# EasyEDA Pro project 校赛123.eprj, schematic Schematic2
Board Name: Board2; Create Date: 2025-10-29; Page Name: P1; Project Name: 校赛123; Schematic Name: Schematic2; Update Date: 2025-11-05; Company: 嘉立创EDA; Page Size: A4; Version: V1.0
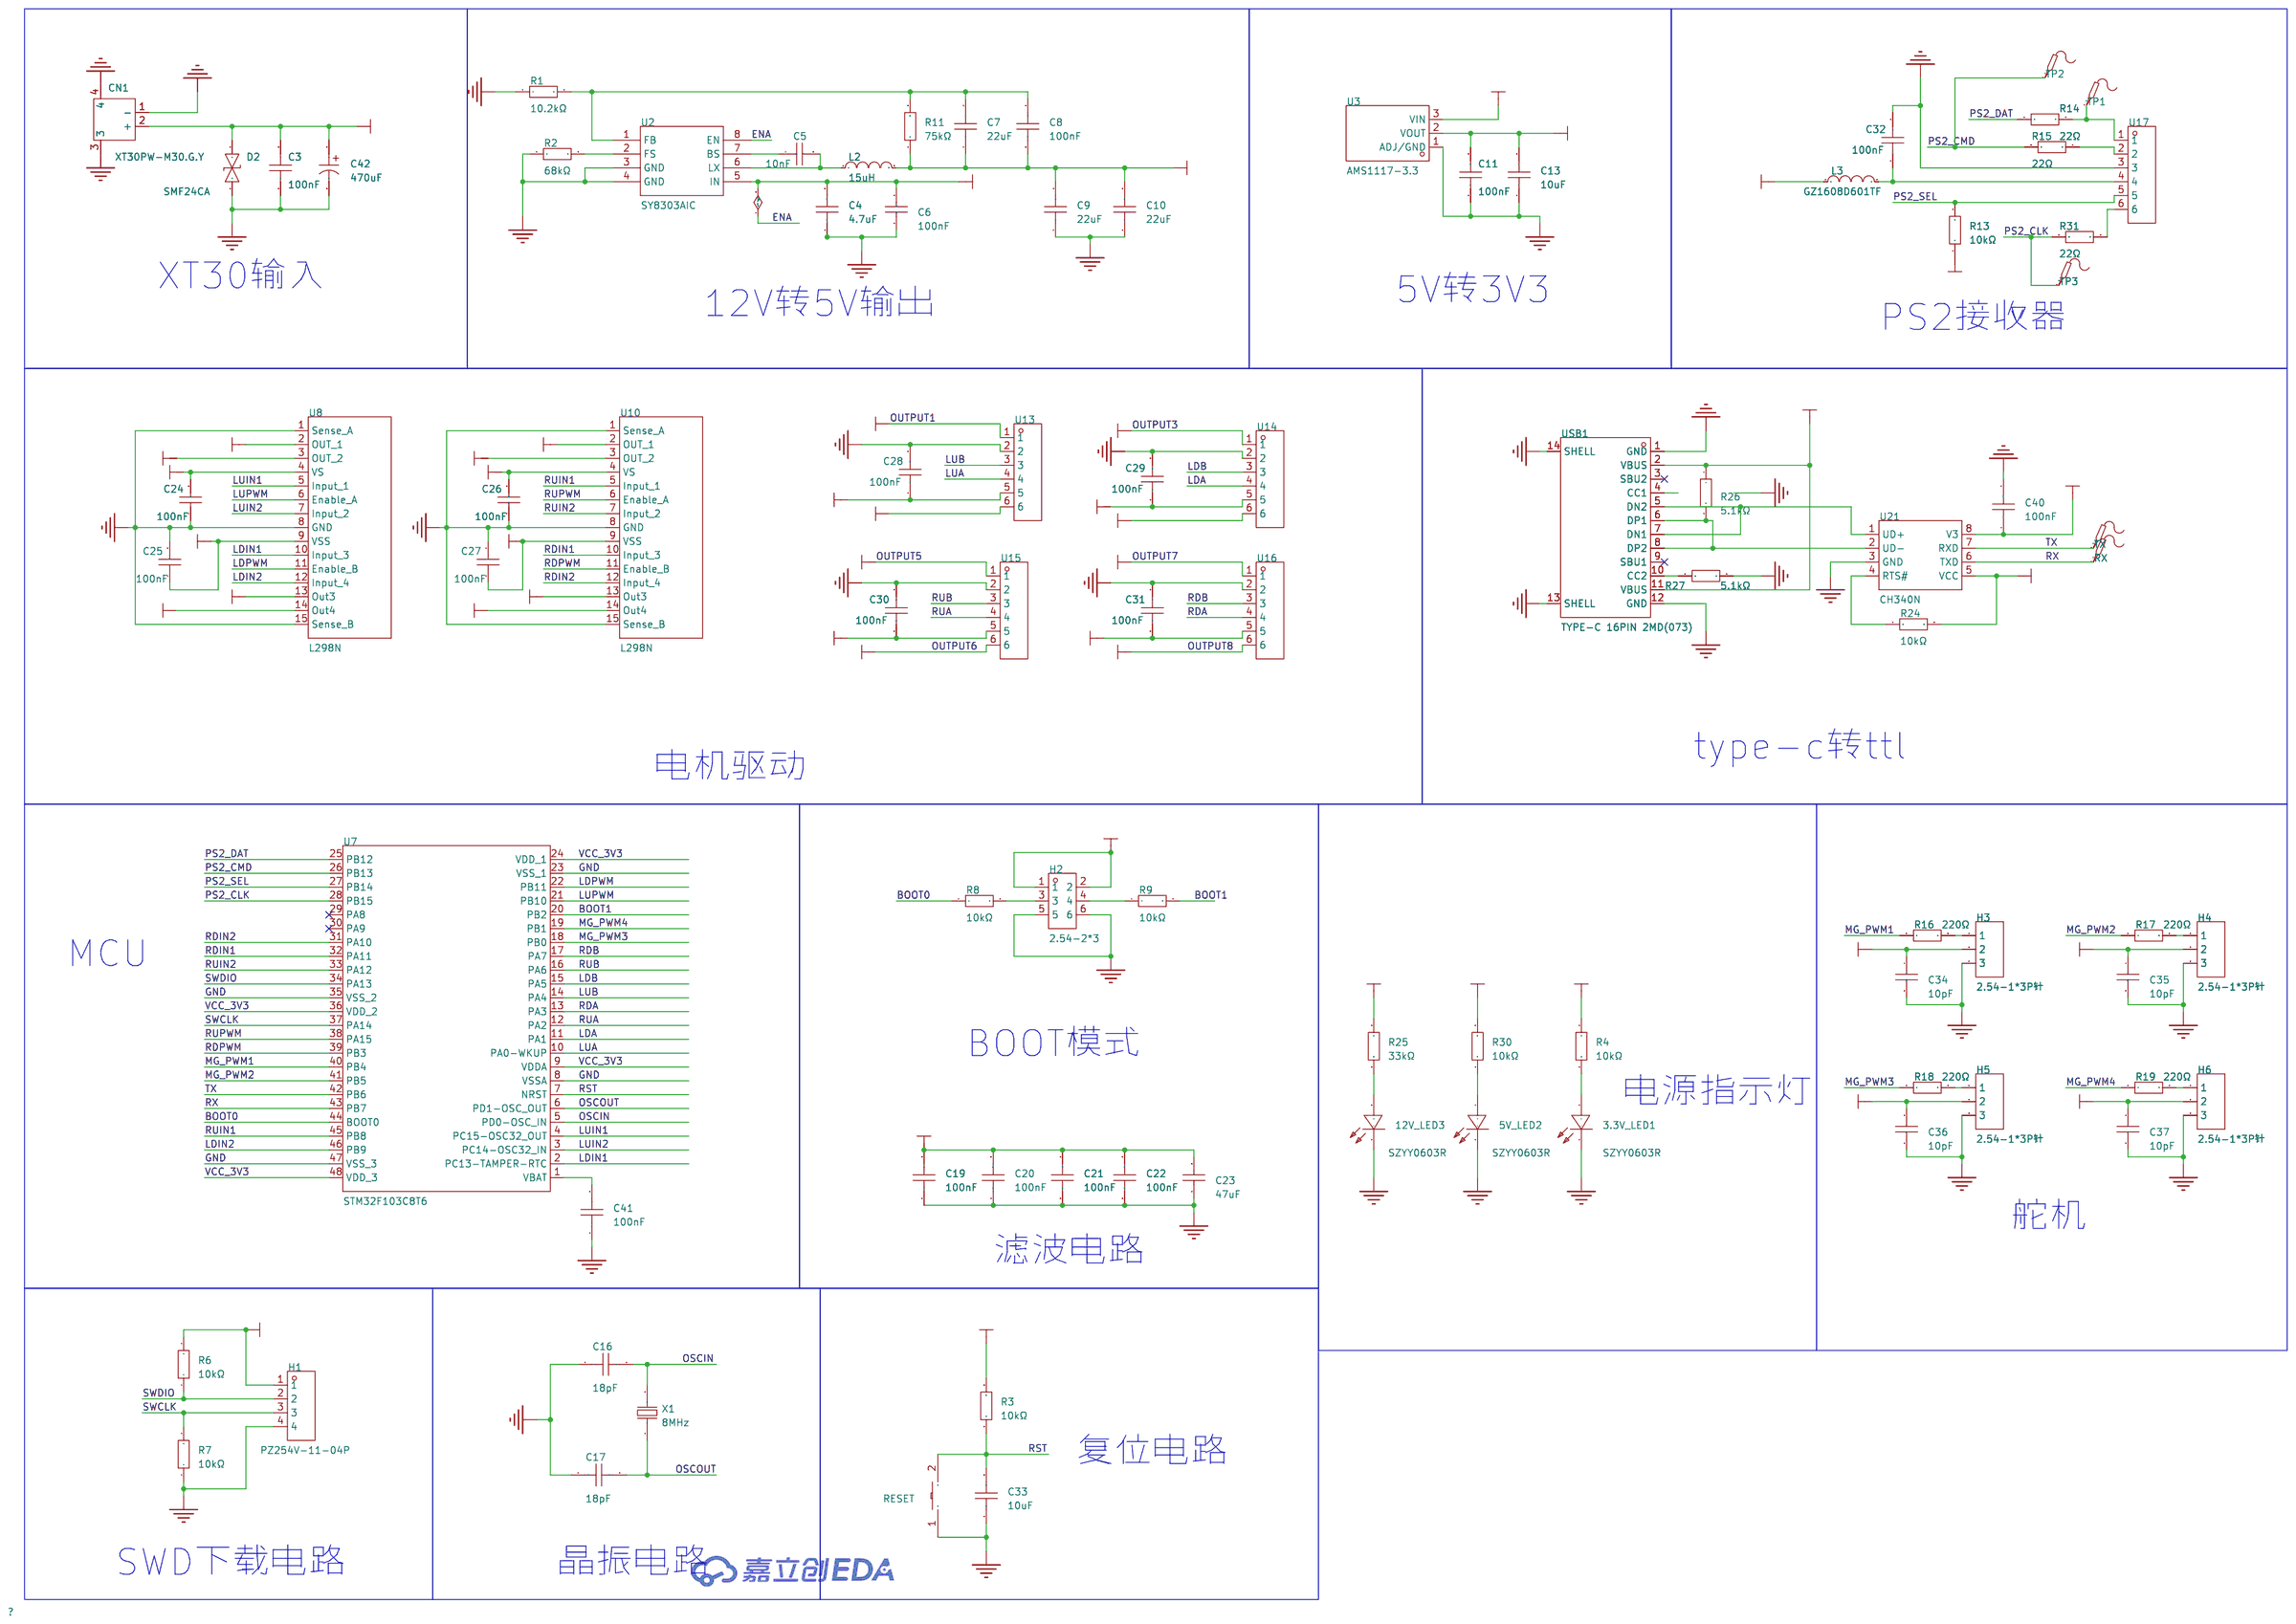
[diagram p1: schematic sheet]

## Parts
3.3V_LED1  SZYY0603R  [LED0603-R-RD]
5V_LED2  SZYY0603R  [LED0603-R-RD]
12V_LED3  SZYY0603R  [LED0603-R-RD]
C3  100nF  [C0603]
C4  4.7uF  [C0603]
C5  10nF  [C0603]
C6  100nF  [C0603]
C7  22uF  [C0603]
C8  100nF  [C0603]
C9  22uF  [C0603]
C10  22uF  [C0603]
C11  100nF  [C0603]
C13  10uF  [C0603]
C16  18pF  [C0603]
C17  18pF  [C0603]
C19  100nF  [C0603]
C20  100nF  [C0603]
C21  100nF  [C0603]
C22  100nF  [C0603]
C23  47uF  [C0603]
C24  100nF  [C0603]
C25  100nF  [C0603]
C26  100nF  [C0603]
C27  100nF  [C0603]
C28  100nF  [C0603]
C29  100nF  [C0603]
C30  100nF  [C0603]
C31  100nF  [C0603]
C32  100nF  [C0603]
C33  10uF  [C0603]
C34  10pF  [C0603]
C35  10pF  [C0603]
C36  10pF  [C0603]
C37  10pF  [C0603]
C40  100nF  [C0603]
C41  100nF  [C0603]
C42  470uF  [CAP-SMD_BD10.0-L10.3-W10.3-LS11.0]
CN1  XT30PW-M30.G.Y  [CONN-TH_XT30PW-M]
D2  SMF24CA  [SOD-123FL_L2.7-W1.8-LS3.8-BI]
H1  PZ254V-11-04P  [HDR-TH_4P-P2.54-V-M]
H2  2.54-2*3  [HDR-TH_6P-P2.54-V-R2-C3-S2.54_A2541WV-2X3P]
H3  2.54-1*3P针  [HDR-TH_3P-P2.54-V-M-1]
H4  2.54-1*3P针  [HDR-TH_3P-P2.54-V-M-1]
H5  2.54-1*3P针  [HDR-TH_3P-P2.54-V-M-1]
H6  2.54-1*3P针  [HDR-TH_3P-P2.54-V-M-1]
L2  15uH  [IND-SMD_L4.0-W4.0]
L3  GZ1608D601TF  [L0603]
R1  10.2kΩ  [R0603]
R2  68kΩ  [R0603]
R3  10kΩ  [R0603]
R4  10kΩ  [R0603]
R6  10kΩ  [R0603]
R7  10kΩ  [R0603]
R8  10kΩ  [R0603]
R9  10kΩ  [R0603]
R11  75kΩ  [R0603]
R13  10kΩ  [R0603]
R14  22Ω  [R0603]
R15  22Ω  [R0603]
R16  220Ω  [R0603]
R17  220Ω  [R0603]
R18  220Ω  [R0603]
R19  220Ω  [R0603]
R24  10kΩ  [R0603]
R25  33kΩ  [R0603]
R26  5.1kΩ  [R0603]
R27  5.1kΩ  [R0603]
R30  10kΩ  [R0603]
R31  22Ω  [R0603]
RESET  TS-1101-C-W  [SW-SMD_L6.0-W3.3-LS8.0]
RX  -  [Test-Point-0.5mm]
TP1  -  [Test-Point-0.5mm]
TP2  -  [Test-Point-0.5mm]
TP3  -  [Test-Point-0.5mm]
TX  -  [Test-Point-0.5mm]
U2  SY8303AIC  [TSOT-23-8_L2.9-W1.6-P0.65-LS2.8-BR]
U3  AMS1117-3.3  [SOT-89-3_L4.5-W2.5-P1.50-LS4.2-BR]
U7  STM32F103C8T6  [LQFP-48_L7.0-W7.0-P0.50-LS9.0-BL]
U8  L298N  [MULTIWATT-15_L19.6-W5.0-P1.27-L]
U10  L298N  [MULTIWATT-15_L19.6-W5.0-P1.27-L]
U13  ZX-XH2.54-6PZZ  [CONN-TH_6P-P2.50_ZX-XH2.54-6PZZ]
U14  ZX-XH2.54-6PZZ  [CONN-TH_6P-P2.50_ZX-XH2.54-6PZZ]
U15  ZX-XH2.54-6PZZ  [CONN-TH_6P-P2.50_ZX-XH2.54-6PZZ]
U16  ZX-XH2.54-6PZZ  [CONN-TH_6P-P2.50_ZX-XH2.54-6PZZ]
U17  ZX-XH2.54-6PZZ  [CONN-TH_6P-P2.50_ZX-XH2.54-6PZZ]
U21  CH340N  [SOP-8_L4.9-W3.9-P1.27-LS6.0-BL]
USB1  TYPE-C 16PIN 2MD(073)  [USB-C-SMD_TYPE-C-6PIN-2MD-073]
X1  8MHz  [CRYSTAL-SMD_L11.4-W4.7-LS12.7]

## Library data of the parts
3.3V_LED1 5V_LED2 12V_LED3 = SZYY0603R: 发光颜色:红色;功率:40mW;正向电流:20mA;主波长:615nm~630nm;二极管配置:-;透镜颜色:无色透明透镜;色温:-;发光角度:120°;载带方式:-;工作温度:-40℃~+85℃;; LCSC Part Name: 红灯; Supplier Part: C434419; Manufacturer: yongyu(永裕光电); Supplier Footprint: 0603; JLCPCB Part Class: 扩展库; Datasheet: https://atta.szlcsc.com/upload/public/pdf/source/20191204/C434419_0B955C1F73FF88449D9A795B6FF49070.pdf; Supplier: LCSC; Emitted Color: 红色; Power Dissipation: 40mW; Forward Current: 20mA; Dominant Wavelength: 615nm~630nm; Peak Wavelength: 645nm; Lens Color: 无色透明透镜; Viewing Angle: 120°; Operating Temperature: -40℃~+85℃
C3 C11 C22 C28-C32 C40 = CL10B104KB8NNNC: LCSC Part Name: 100nF ±10% 50V; Supplier Part: C1591; Manufacturer: SAMSUNG(三星); Supplier Footprint: 0603; JLCPCB Part Class: 扩展库; Datasheet: https://item.szlcsc.com/datasheet/CL10B104KB8NNNC/1943.html; Supplier: LCSC; Tolerance: ±10%; Voltage Rating: 50V; Temperature Coefficient: X7R
C4 = CL10A475KO8NNNC: LCSC Part Name: 4.7uF ±10% 16V; Supplier Part: C19666; Manufacturer: SAMSUNG(三星); Supplier Footprint: 0603; JLCPCB Part Class: Basic Part; Datasheet: https://item.szlcsc.com/datasheet/CL10A475KO8NNNC/20375.html; Supplier: LCSC; Tolerance: ±10%; Voltage Rating: 16V; Temperature Coefficient: X5R
C5 = CC0603KRX7R9BB103: LCSC Part Name: 10nF ±10% 50V; Supplier Part: C100042; Manufacturer: YAGEO(国巨); Supplier Footprint: 0603; JLCPCB Part Class: Extended Part; Datasheet: https://item.szlcsc.com/datasheet/CC0603KRX7R9BB103/101256.html; Supplier: LCSC; Tolerance: ±10%; Voltage Rating: 50V; Temperature Coefficient: X7R
C6 C8 C19-C21 C24-C27 = CL10B104KB8NNNC: LCSC Part Name: 100nF ±10% 50V; Supplier Part: C1591; Manufacturer: SAMSUNG(三星); Supplier Footprint: 0603; JLCPCB Part Class: Extended Part; Datasheet: https://item.szlcsc.com/datasheet/CL10B104KB8NNNC/1943.html; Supplier: LCSC; Tolerance: ±10%; Voltage Rating: 50V; Temperature Coefficient: X7R
C7 C9 C10 = CL10A226MQ8NRNC: LCSC Part Name: 22uF ±20% 6.3V; Supplier Part: C59461; Manufacturer: SAMSUNG(三星); Supplier Footprint: 0603; JLCPCB Part Class: Basic Part; Datasheet: https://item.szlcsc.com/datasheet/CL10A226MQ8NRNC/60514.html; Supplier: LCSC; Tolerance: ±20%; Voltage Rating: 6.3V; Temperature Coefficient: X5R
C13 C33 = CL10A106KP8NNNC: LCSC Part Name: 10uF ±10% 10V; Supplier Part: C19702; Manufacturer: SAMSUNG(三星); Supplier Footprint: 0603; JLCPCB Part Class: Basic Part; Datasheet: https://item.szlcsc.com/datasheet/CL10A106KP8NNNC/20411.html; Supplier: LCSC; Tolerance: ±10%; Voltage Rating: 10V; Temperature Coefficient: X5R
C16 C17 = FCC0603N180J500CT: LCSC Part Name: 18pF ±5% 50V; Supplier Part: C5137620; Manufacturer: FOJAN(富捷); Supplier Footprint: 0603; JLCPCB Part Class: 扩展库; Datasheet: https://atta.szlcsc.com/upload/public/pdf/source/20220818/0EB3B7FB2F5648AC16609637FBA7DABE.pdf; Supplier: LCSC; Tolerance: ±5%; Voltage Rating: 50V; Temperature Coefficient: C0G
C23 = GRM188R60J476ME15D: LCSC Part Name: 47uF ±20% 6.3V; Supplier Part: C140782; Manufacturer: muRata(村田); Supplier Footprint: 0603; JLCPCB Part Class: 扩展库; Datasheet: https://item.szlcsc.com/datasheet/GRM188R60J476ME15D/152108.html; Supplier: LCSC; Tolerance: ±20%; Voltage Rating: 6.3V; Temperature Coefficient: X5R
C34-C37 = CL10C100JB8NNNC: LCSC Part Name: 10pF ±5% 50V; Supplier Part: C1634; Manufacturer: SAMSUNG(三星); Supplier Footprint: 0603; JLCPCB Part Class: 基础库; Datasheet: https://item.szlcsc.com/datasheet/CL10C100JB8NNNC/1986.html; Supplier: LCSC; Tolerance: ±5%; Voltage Rating: 50V; Temperature Coefficient: C0G
C41 = CAP_0603: Supplier Footprint: 0603
C42 = JVJ35V470M10x10: LCSC Part Name: 470uF ±20% 35V; Supplier Part: C46550413; Manufacturer: JIERR(捷而瑞); Supplier Footprint: SMD,D10xL10.5mm; JLCPCB Part Class: 扩展库; Datasheet: https://item.szlcsc.com/datasheet/JVJ35V470M10x10/48680107.html; Supplier: LCSC; Tolerance: ±20%; Voltage Rating: 35V; Ripple Current: 320mA@120Hz; Diameter: 10mm; Height - Seated (Max): 10.5mm; Lifetime: 2000hrs@105℃; Operating Temperature: -55℃~+105℃
CN1 = XT30PW-M30.G.Y: LCSC Part Name: AMASS(艾迈斯)航模插头 卧式弯脚 XT30PW-M公头; Supplier Part: C431092; Manufacturer: AMASS(艾迈斯); JLCPCB Part Class: 扩展库; Datasheet: https://item.szlcsc.com/datasheet/XT30PW-M30.G.Y/426930.html; Supplier: LCSC; Type: 航模插头; RatedVoltage: DC 500V; InterfaceType: 公头; RatedCurrent: 15A; RecommendedWireGauge: 16/18/20AWG; contact resistance: 1.2mΩ; specifications: 2pin
D2 = SMF24CA_C19077515: LCSC Part Name: 双向TVS 24V截止 峰值浪涌电流：5.1A@10/1000us; Supplier Part: C19077515; Manufacturer: R+O(宏嘉诚); Supplier Footprint: SOD-123FL; JLCPCB Part Class: 扩展库; Datasheet: https://item.szlcsc.com/datasheet/SMF24CA/20275600.html; Supplier: LCSC; Polarity: 双向; Reverse Stand-Off Voltage (Vrwm): 24V; Clamping Voltage: 38.9V; Peak Pulse Current (Ipp): 5.1A@10/1000us; Peak Pulse Power Dissipation (Ppp): 200W@10/1000us; Voltage - Breakdown: 29.5V; Reverse Leakage Current (Ir): 1uA; Operating Temperature: -55℃~+150℃; level of protection: IEC 61000-4-2; Type: TVS
H1 = PZ254V-11-04P: LCSC Part Name: 1x4P 间距:2.54mm 方针 直插; Supplier Part: C2691448; Manufacturer: XFCN(兴飞); Supplier Footprint: 插件,P=2.54mm; JLCPCB Part Class: 扩展库; Datasheet: https://item.szlcsc.com/datasheet/PZ254V-11-04P/2801085.html; Supplier: LCSC; Pin Structure: 1x4P; Pitch: 2.54mm; Circluar Pins/Square Pins: 方针; Mounting Type: 直插; Number of Rows: 单排; Number of Pins: 4P; Current Rating: 3A; Voltage Rating (Max): 250V; Length of Mating Pin: 6mm; Insulation Height: 2.5mm; Length of End Connection Pin: 3mm; Operating Temperature: -40℃~+105℃; Color: 黑色
H2 = 2.54-2*3: LCSC Part Name: 2x3P 间距:2.54mm 方针 直插; Supplier Part: C5116479; Manufacturer: ZHOURI(洲日); Supplier Footprint: 插件,P=2.54mm; JLCPCB Part Class: 扩展库; Datasheet: https://item.szlcsc.com/datasheet/2.54-2*3/5692722.html; Supplier: LCSC; Pin Structure: 2x3P; Pitch: 2.54mm; Row Spacing: 2.54mm; Circluar Pins/Square Pins: 方针; Mounting Type: 直插; Number of Rows: 双排; Number of Pins: 6P; Current Rating: 2.5A; Length of Mating Pin: 6mm; Insulation Height: 2.54mm; Length of End Connection Pin: 3mm; Contact Material: 黄铜; Contact Plating: 金; Operating Temperature: -40℃~+105℃
H3-H6 = 2.54-1*3P针: LCSC Part Name: 1x3P 间距:2.54mm 方针 直插; Supplier Part: C49257; Manufacturer: BOOMELE(博穆精密); Supplier Footprint: 插件,P=2.54mm; JLCPCB Part Class: 扩展库; Datasheet: https://item.szlcsc.com/datasheet/2.54-1*3P%25E9%2592%2588/50265.html; Supplier: LCSC; Pin Structure: 1x3P; Pitch: 2.54mm; Circluar Pins/Square Pins: 方针; Mounting Type: 直插; Number of Rows: 单排; Number of Pins: 3P; Current Rating: 3A; Length of Mating Pin: 6mm; Insulation Height: 2.5mm; Length of End Connection Pin: 3mm; Contact Material: 黄铜; Contact Plating: 金; Operating Temperature: -40℃~+105℃; Color: 黑色
L2 = FHD4020S-150MT: LCSC Part Name: 15uH ±20% 2.8A; Supplier Part: C602033; Manufacturer: cjiang(长江微电); Supplier Footprint: SMD,4x4mm; JLCPCB Part Class: 扩展库; Datasheet: https://atta.szlcsc.com/upload/public/pdf/source/20200609/C601990_BCEA243EC4DA0A9A288AA78A6DFB48A5.pdf; Supplier: LCSC; Tolerance: ±20%; Current Rating: 1.2A; Current - Saturation(Isat): 2.8A; DC Resistance(DCR): 305mΩ; Type: 绕线电感
L3 = GZ1608D601TF: LCSC Part Name: 单路 0603磁珠 阻抗600Ω@100MHz; Supplier Part: C1002; Manufacturer: Sunlord(顺络); Supplier Footprint: 0603; JLCPCB Part Class: 基础库; Datasheet: https://atta.szlcsc.com/upload/public/pdf/source/20241120/893429B990C3BA07384E734821D2F218.pdf; Supplier: LCSC; Impedance @ Frequency: 600Ω@100MHz; Tolerance: ±25%; DC Resistance: 450mΩ; Current Rating: 200mA; Circuits: 1
R1 = 0603WAF1022T5E: LCSC Part Name: 10.2kΩ ±1% 100mW 厚膜电阻; Supplier Part: C22772; Manufacturer: UNI-ROYAL(厚声); Supplier Footprint: 0603; JLCPCB Part Class: 扩展库; Datasheet: https://item.szlcsc.com/datasheet/0603WAF1022T5E/23499.html; Supplier: LCSC; Type: 厚膜电阻; Tolerance: ±1%; Power(Watts): 100mW; Voltage-Supply(Max): 75V; Temperature Coefficient: ±100ppm/℃; Operating Temperature: -55℃~+155℃
R2 = 0603WAF6802T5E: LCSC Part Name: 68kΩ ±1% 100mW 厚膜电阻; Supplier Part: C23231; Manufacturer: UNI-ROYAL(厚声); Supplier Footprint: 0603; JLCPCB Part Class: 基础库; Datasheet: https://item.szlcsc.com/datasheet/0603WAF6802T5E/23958.html; Supplier: LCSC; Type: 厚膜电阻; Tolerance: ±1%; Power(Watts): 100mW; Voltage-Supply(Max): 75V; Temperature Coefficient: ±100ppm/℃; Operating Temperature: -55℃~+155℃
R3 R6-R9 R13 R24 R30 = 0603WAF1002T5E: 电阻类型:厚膜电阻;阻值:10kΩ;精度:±1%;功率:100mW;工作电压:75V;温度系数:±100ppm/℃;; LCSC Part Name: 厚膜电阻 10kΩ ±1% 100mW; Supplier Part: C25804; Manufacturer: UNI-ROYAL(厚声); Supplier Footprint: 0603; JLCPCB Part Class: 基础库; Datasheet: https://item.szlcsc.com/datasheet/0603WAF1002T5E/26547.html; Supplier: LCSC; Type: 厚膜电阻; Tolerance: ±1%; Power(Watts): 100mW; Voltage-Supply(Max): 75V; Temperature Coefficient: ±100ppm/℃; Operating Temperature: -55℃~+155℃
R4 = 0603WAF1002T5E: 电阻类型:厚膜电阻;阻值:10kΩ;精度:±1%;功率:100mW;工作电压:75V;温度系数:±100ppm/℃;; LCSC Part Name: 厚膜电阻 10kΩ ±1% 100mW; Supplier Part: C25804; Manufacturer: UNI-ROYAL(厚声); Supplier Footprint: 0603; JLCPCB Part Class: Basic Part; Datasheet: https://item.szlcsc.com/datasheet/0603WAF1002T5E/26547.html; Supplier: LCSC; Type: 厚膜电阻; Tolerance: ±1%; Power(Watts): 100mW; Voltage-Supply(Max): 75V; Temperature Coefficient: ±100ppm/℃; Operating Temperature: -55℃~+155℃
R11 = 0603WAF7502T5E: LCSC Part Name: 75kΩ ±1% 100mW 厚膜电阻; Supplier Part: C23242; Manufacturer: UNI-ROYAL(厚声); Supplier Footprint: 0603; JLCPCB Part Class: 基础库; Datasheet: https://item.szlcsc.com/datasheet/0603WAF7502T5E/23969.html; Supplier: LCSC; Type: 厚膜电阻; Tolerance: ±1%; Power(Watts): 100mW; Voltage-Supply(Max): 75V; Temperature Coefficient: ±100ppm/℃; Operating Temperature: -55℃~+155℃
R14 R15 R31 = 0603WAF220JT5E: LCSC Part Name: 22Ω ±1% 100mW 厚膜电阻; Supplier Part: C23345; Manufacturer: UNI-ROYAL(厚声); Supplier Footprint: 0603; JLCPCB Part Class: 基础库; Datasheet: https://atta.szlcsc.com/upload/public/pdf/source/20200306/C422600_1E6D84923E4A46A82E41ADD87F860B5C.pdf; Supplier: LCSC; Type: 厚膜电阻; Tolerance: ±1%; Power(Watts): 100mW; Overload Voltage (Max): 75V; Temperature Coefficient: ±100ppm/℃; Operating Temperature Range: -55℃~+155℃
R16-R19 = 0603WAF2200T5E: LCSC Part Name: 220Ω ±1% 100mW 厚膜电阻; Supplier Part: C22962; Manufacturer: UNI-ROYAL(厚声); Supplier Footprint: 0603; JLCPCB Part Class: 基础库; Datasheet: https://atta.szlcsc.com/upload/public/pdf/source/20200306/C422600_1E6D84923E4A46A82E41ADD87F860B5C.pdf; Supplier: LCSC; Type: 厚膜电阻; Tolerance: ±1%; Power(Watts): 100mW; Overload Voltage (Max): 75V; Temperature Coefficient: ±100ppm/℃; Operating Temperature Range: -55℃~+155℃
R25 = 0603WAF3302T5E: LCSC Part Name: 33kΩ ±1% 100mW 厚膜电阻; Supplier Part: C4216; Manufacturer: UNI-ROYAL(厚声); Supplier Footprint: 0603; JLCPCB Part Class: 基础库; Datasheet: https://item.szlcsc.com/datasheet/0603WAF3302T5E/4623.html; Supplier: LCSC; Type: 厚膜电阻; Tolerance: ±1%; Power(Watts): 100mW; Voltage-Supply(Max): 75V; Temperature Coefficient: ±100ppm/℃; Operating Temperature: -55℃~+155℃
R26 R27 = 0603WAF5101T5E: LCSC Part Name: 5.1kΩ ±1% 100mW 厚膜电阻; Supplier Part: C23186; Manufacturer: UNI-ROYAL(厚声); Supplier Footprint: 0603; JLCPCB Part Class: 基础库; Datasheet: https://item.szlcsc.com/datasheet/0603WAF5101T5E/23913.html; Supplier: LCSC; Type: 厚膜电阻; Tolerance: ±1%; Power(Watts): 100mW; Voltage-Supply(Max): 75V; Temperature Coefficient: ±100ppm/℃; Operating Temperature: -55℃~+155℃
RESET = TS-1101-C-W: 电路结构:单刀单掷;按钮形状:矩形按钮;作用力:260gf;安装方式:立贴;开关长度:6mm;开关宽度:3.6mm;开关高度:2.5mm;带支架:不带;触点电流:50mA;额定电压(AC):-;额定电压(DC):12V;额定功率:-;绝缘电阻:-;带灯:无;机械寿命:5万次;; LCSC Part Name: 6*3.6*2.5mm 立贴 轻触开关; Supplier Part: C318938; Manufacturer: XKB Connectivity(中国星坤); Supplier Footprint: SMD; JLCPCB Part Class: 扩展库; Datasheet: https://atta.szlcsc.com/upload/public/pdf/source/20200227/C318938_C2E53B1EEDE37D980A33616AC086DE53.pdf; Supplier: LCSC; Circuit: 单刀单掷; Actuator Style: 矩形按钮; Operating Force: 260gf; Mounting Style: 立贴; Switch Length: 6mm; Switch Width: 3.6mm; Switch Height: 2.5mm; Strike Gundam: 不带; Contact Current: 50mA; Voltage Rating (DC): 12V; Actuator/Cap Color: 白色带淡绿; With Lamp: 无; Mechanical Life: 5万次; Operating Temperature: -30℃~+85℃
RX TP1-TP3 TX = Test-Point
U2 = SY8303AIC: LCSC Part Name: 高效率快速响应3A 40V输入同步降压调节器; Supplier Part: C97054; Manufacturer: silergy(矽力杰); Supplier Footprint: TSOT-23-8; JLCPCB Part Class: 扩展库; Datasheet: https://atta.szlcsc.com/upload/public/pdf/source/20170308/1488958431714.pdf; Supplier: LCSC; Function: 降压型; Input Voltage: 4.5V~40V; Switching Frequency: 500kHz~2.5MHz; Operating Temperature: -40℃~+105℃; Synchronous Rectification: 是; Number of Outputs: 1; Topology: 降压式; Quiescent Current (Iq): 18uA
U3 = AMS1117-3.3_C880752: 输出类型:-;; Supplier Part: C880752; Manufacturer: Slkor(萨科微); Supplier Footprint: SOT-89; JLCPCB Part Class: Extended Part; Datasheet: https://atta.szlcsc.com/upload/public/pdf/source/20201231/C426566_7F22DB93439D00F3FA27143E4F28C6AA.pdf; Supplier: LCSC
U7 = STM32F103C8T6: LCSC Part Name: 主流增强型ARM Cortex-M3 MCU，具有64 KB Flash、72 MHz CPU、电机控制、USB和CAN; Supplier Part: C8734; Manufacturer: ST(意法半导体); Supplier Footprint: LQFP-48(7x7); JLCPCB Part Class: 扩展库; Datasheet: https://item.szlcsc.com/datasheet/STM32F103C8T6/9243.html; Supplier: LCSC; CPU Core: ARM-M3; CPU Maximum Speed: 72MHz; Program Storage Size: 64KB; Program Memory Type: FLASH; Number of I/O: 37; ADC (Bit): 12bit; Voltage - Supply: 2V~3.6V
U8 U10 = L298N_C434589: Supplier Part: C434589; Manufacturer: HGSEMI(华冠); Supplier Footprint: Multiwatt-15; JLCPCB Part Class: 扩展库; Datasheet: https://item.szlcsc.com/datasheet/L298N/431682.html; Supplier: LCSC; Number of H-bridges: 2; Operating Temperature: -25℃~+130℃
U13-U17 = ZX-XH2.54-6PZZ: LCSC Part Name: 1x6P 间距:2.5mm 直插 系列:XH; Supplier Part: C7429636; Manufacturer: Megastar(兆星); Supplier Footprint: 插件,P=2.5mm; JLCPCB Part Class: Extended Part; Datasheet: https://item.szlcsc.com/datasheet/ZX-XH2.54-6PZZ/8427553.html; Supplier: LCSC; Pins Structure: 1x6P; Pitch: 2.5mm; Mounting Type: 直插; Reference Series: XH; Number of Pins: 6P; Number of Rows: 1; Number of PINs Per Row: 6; Current Rating: 3A; Contact Material: 黄铜; Contact Plating: 锡; Operating Temperature: -25℃~+85℃; Voltage Rating: 250V; Plastic Material: PA66; Flame Retardant Rating: UL94V-0; Color: 白色; Z-Height of the Board: 7mm; X-Length of Bottom Edge on Board (Spacing Line): 17.5mm; Y-Width of Bottom Edge on Board: 5.9mm
U21 = CH340N: LCSC Part Name: USB2.0芯片CH340; Supplier Part: C2977777; Manufacturer: WCH(南京沁恒); Supplier Footprint: SOP-8; JLCPCB Part Class: 扩展库; Datasheet: https://atta.szlcsc.com/upload/public/pdf/source/20240313/115CDE92081B1D6CB446704AD5D0F5F2.pdf; Supplier: LCSC; Applications Function: USB转串口; Protocol: USB 2.0; Number of Channels: 1; Voltage - Supply: 3.3V；5V; Data Rate: 2Mbps; Operating Temperature: -20℃~+70℃
USB1 = TYPE-C 16PIN 2MD(073): LCSC Part Name: Type-C 母 卧贴; Supplier Part: C2765186; Manufacturer: SHOU HAN(首韩); Supplier Footprint: SMD; JLCPCB Part Class: 扩展库; Datasheet: https://item.szlcsc.com/datasheet/TYPE-C%252016PIN%25202MD(073)/2901843.html; Supplier: LCSC; Connector Type: Type-C; Gender: 母; Mounting Type: 卧贴; Number of Contacts: 16P; Number of Ports: 1; Current Rating-Power: 3A; Voltage Rating: 5V; Connect-Disconnect Life: 5千次; Detection color: 黑色; Operating Temperature: -25℃~+85℃
X1 = HY8M49SSMDOB2R20: LCSC Part Name: 8MHz ±20ppm 20pF; Supplier Part: C5265773; Manufacturer: Huiyuan crystal(惠源晶工); Supplier Footprint: HC-49S-SMD; JLCPCB Part Class: 扩展库; Datasheet: https://atta.szlcsc.com/upload/public/pdf/source/20221116/333EA273EAF0AB1E8F7E2EF18988D55B.pdf; Supplier: LCSC; Normal temperature Frequency Tolerance: ±20ppm; Load Capacitance: 20pF; Frequency Stability: ±50ppm; Equivalent Series Resistance(ESR): 60Ω; Operating Temperature: -40℃~+85℃

## Nets
GND: 3.3V_LED1.2(-) 5V_LED2.2(-) 12V_LED3.2(-) C3.1 C4.1 C6.1 C9.1 C10.1 C11.1 C13.1 C16.1 C17.1 C19.1 C20.1 C21.1 C22.1 C23.1 C24.1 C25.2 C26.1 C27.2 C28.2 C29.2 C30.2 C31.2 C32.2 C33.1 C34.2 C35.2 C36.2 C37.2 C40.2 C41.1 C42.2 CN1.1(-) CN1.3 CN1.4 D2.1(K) H1.4 H2.5 H2.6 H3.3 H4.3 H5.3 H6.3 R1.1 R2.1 R7.1 R27.1 RESET.1 U2.3(GND) U2.4(GND) U3.1(ADJ/GND) U7.8(VSSA) U7.23(VSS_1) U7.35(VSS_2) U7.47(VSS_3) U8.1(Sense A) U8.8(GND) U8.15(Sense B) U10.1(Sense A) U10.8(GND) U10.15(Sense B) U13.2 U14.2 U15.2 U16.2 U17.3 U21.3(GND) USB1.1(GND) USB1.12(GND) USB1.13(SHELL) USB1.14(SHELL)
VCC_3V3: C11.2 C13.2 C19.2 C20.2 C21.2 C22.2 C23.2 C40.1 H1.1 H2.1 H2.2 R3.2 R4.1 R6.2 R13.1 R24.2 U3.2(VOUT) U7.9(VDDA) U7.24(VDD_1) U7.36(VDD_2) U7.48(VDD_3) U21.5(VCC) U21.8(V3)
VCC_5V: C7.1 C8.2 C9.2 C10.2 C25.1 C27.1 C28.1 C29.1 C30.1 C31.1 C34.1 C35.1 C36.1 C37.1 H3.2 H4.2 H5.2 H6.2 L2.2 L3.1 R11.1 R26.1 R30.2 U3.3(VIN) U8.9(VSS) U10.9(VSS) U13.5 U14.5 U15.5 U16.5 USB1.2(VBUS) USB1.11(VBUS)
VCC_12V: C3.2 C4.2 C6.2 C24.2 C26.2 C42.1 CN1.2(+) D2.2(A) R25.1 U2.5(IN) U2.8(EN) U8.4(VS) U10.4(VS)
BOOT0: R8.1 U7.44(BOOT0)
BOOT1: R9.2 U7.20(PB2)
LDA: U7.11(PA1) U14.4
LDB: U7.15(PA5) U14.3
LDIN1: U7.2(PC13-TAMPER-RTC) U8.10(Input 3)
LDIN2: U7.46(PB9) U8.12(Input 4)
LDPWM: U7.22(PB11) U8.11(Enable B)
LUA: U7.10(PA0-WKUP) U13.4
LUB: U7.14(PA4) U13.3
LUIN1: U7.4(PC15-OSC32_OUT) U8.5(Input 1)
LUIN2: U7.3(PC14-OSC32_IN) U8.7(Input 2)
LUPWM: U7.21(PB10) U8.6(Enable A)
MG_PWM1: R16.1 U7.40(PB4)
MG_PWM2: R17.1 U7.41(PB5)
MG_PWM3: R18.1 U7.18(PB0)
MG_PWM4: R19.1 U7.19(PB1)
OSCIN: C16.2 U7.5(PD0-OSC_IN) X1.2
OSCOUT: C17.2 U7.6(PD1-OSC_OUT) X1.1
OUTPUT1: U8.2(OUT 1) U13.1
OUTPUT2: U8.3(OUT 2) U13.6
OUTPUT3: U8.13(Out3) U14.1
OUTPUT4: U8.14(Out4) U14.6
OUTPUT5: U10.2(OUT 1) U15.1
OUTPUT6: U10.3(OUT 2) U15.6
OUTPUT7: U10.13(Out3) U16.1
OUTPUT8: U10.14(Out4) U16.6
PS2_CLK: R31.1 TP3.1 U7.28(PB15)
PS2_CMD: R15.1 TP2.1 U7.26(PB13)
PS2_DAT: R14.1 U7.25(PB12)
PS2_SEL: R13.2 U7.27(PB14) U17.5
RDA: U7.13(PA3) U16.4
RDB: U7.17(PA7) U16.3
RDIN1: U7.32(PA11) U10.10(Input 3)
RDIN2: U7.31(PA10) U10.12(Input 4)
RDPWM: U7.39(PB3) U10.11(Enable B)
RST: C33.2 R3.1 RESET.2 U7.7(NRST)
RUA: U7.12(PA2) U15.4
RUB: U7.16(PA6) U15.3
RUIN1: U7.45(PB8) U10.5(Input 1)
RUIN2: U7.33(PA12) U10.7(Input 2)
RUPWM: U7.38(PA15) U10.6(Enable A)
RX: RX.1 U7.43(PB7) U21.6(TXD)
SWCLK: H1.3 R7.2 U7.37(PA14)
SWDIO: H1.2 R6.1 U7.34(PA13)
TX: TX.1 U7.42(PB6) U21.7(RXD)
$3N1810: C5.2 L2.1 U2.6(LX)
$3N1826: C5.1 U2.7(BS)
$3N2500: C7.2 C8.1 R1.2 R11.2 U2.1(FB)
$3N2612: R2.2 U2.2(FS)
$3N9576: 3.3V_LED1.1(+) R4.2
$3N9713: C41.2 U7.1(VBAT)
$3N11117: H2.3 R8.2
$3N11124: H2.4 R9.1
$3N11714: 5V_LED2.1(+) R30.1
$3N11908: 12V_LED3.1(+) R25.2
$3N23002: R14.2 TP1.1 U17.1
$3N23007: R31.2 U17.6
$3N23602: R15.2 U17.2
$3N23821: C32.1 L3.2 U17.4
$3N24477: H3.1 R16.2
$3N24721: H4.1 R17.2
$3N24879: H5.1 R18.2
$3N25037: H6.1 R19.2
$3N27553: R24.1 U21.4(RTS#)
$3N28060: U21.1(UD+) USB1.5(DN2) USB1.7(DN1)
$3N28063: R27.2 USB1.10(CC2)
Net-(R26-2): R26.2 U21.2(UD-) USB1.6(DP1) USB1.8(DP2)

Not connected (* = marked no-connect by the designer): U7 29(PA8)* 30(PA9)*; USB1 3(SBU2)* 4(CC1) 9(SBU1)*

## Notes on the sheet
- XT30输入
- 5V转3V3
- 12V转5V输出
- PS2接收器
- type-c转ttl
- 电机驱动
- MCU
- BOOT模式
- 电源指示灯
- 舵机
- 滤波电路
- 复位电路
- SWD下载电路
- 晶振电路
